# EAGLE design BeaconKeyer_RevC (EAGLE 7.6.0)

## Sheet 1 of 2
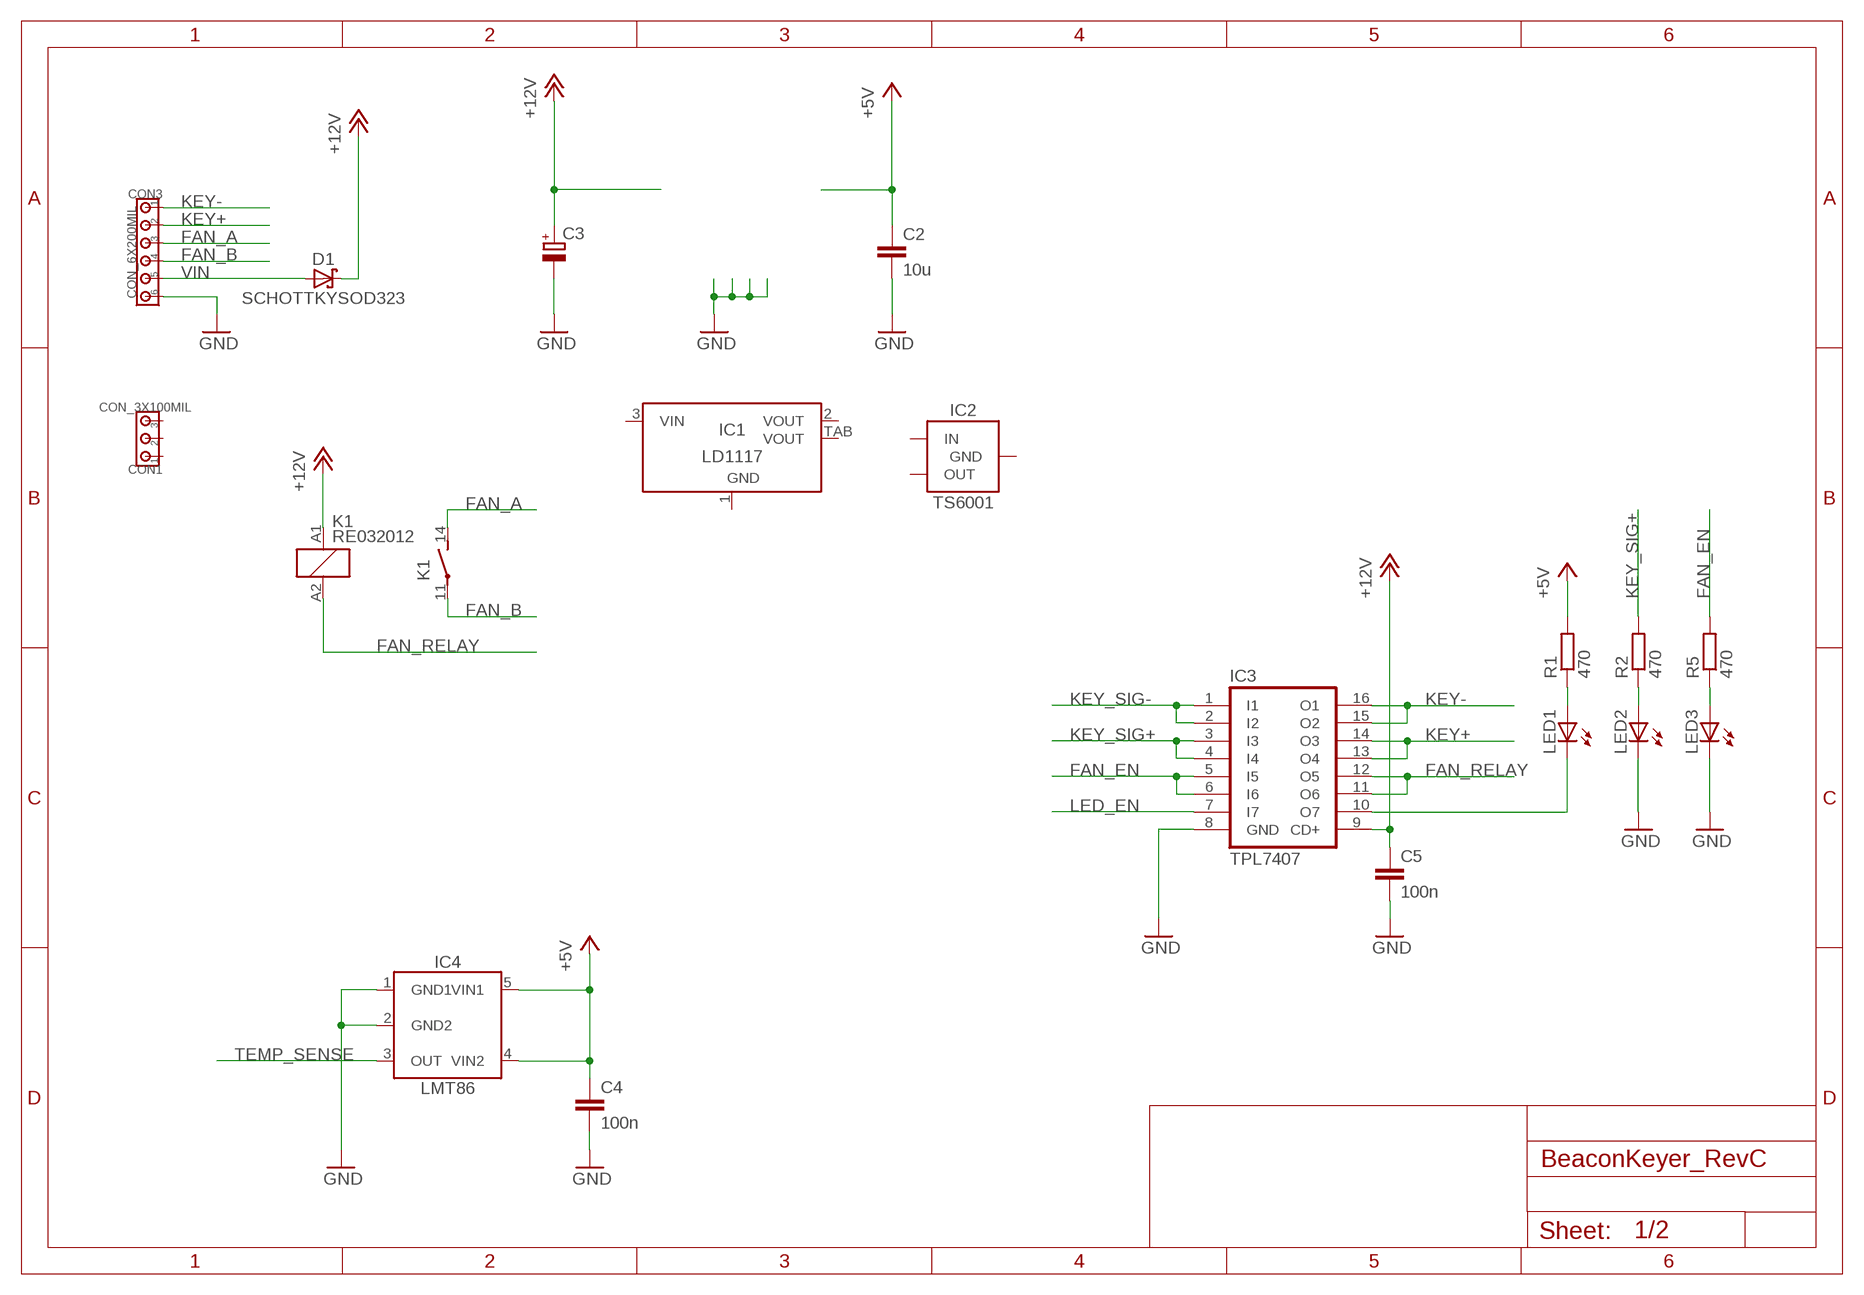
[diagram p0: schematic, sheet 1]

### Parts
C2  10u  CC0805  [C0805]
C3  C_POLARIZEDSMC_B  [SMC_B]
C4  100n  CC0805  [C0805]
C5  100n  CC0805  [C0805]
CON1  CON_3X100MIL  [100MIL_3X]
CON3  CON_6X200MIL  [200MIL_6X]
D1  SCHOTTKYSOD323  [SOD323]
IC1  LD1117  [SOT223]
IC2  TS6001  [SOT23]
IC3  TPL7407  ULN2003  [SO16]
IC4  LMT86  [SC70-5]
K1  RE032012  [RE-SCHRACK]
LED1  LED0805  [LED0805]
LED2  LED0805  [LED0805]
LED3  LED0805  [LED0805]
R1  470  RESISTORR0805  [R0805]
R2  470  RESISTORR0805  [R0805]
R5  470  RESISTORR0805  [R0805]

### Nets
+5V: C2.1 C4.1 IC4.4(VIN2) IC4.5(VIN1) R1.2
+12V: C3.+ C5.1 D1.C IC3.9(CD+) K1.A1 ; also sheet 2
FAN_A: CON3.3 K1.14(2:S)
FAN_B: CON3.4 K1.11(2:P)
FAN_EN: IC3.5(I5) IC3.6(I6) R5.2
FAN_RELAY: IC3.11(O6) IC3.12(O5) K1.A2
GND: C2.2 C3.- C4.2 C5.2 CON3.6 IC3.8(GND) IC4.1(GND1) IC4.2(GND2) LED2.C LED3.C ; also sheet 2
KEY+: CON3.2 IC3.13(O4) IC3.14(O3)
KEY-: CON3.1 IC3.15(O2) IC3.16(O1)
KEY_SIG+: IC3.3(I3) IC3.4(I4) R2.2
KEY_SIG-: IC3.1(I1) IC3.2(I2)
LED_EN: IC3.7(I7)
N$1: LED2.A R2.1
N$2: LED1.A R1.1
N$4: IC3.10(O7) LED1.C
N$5: LED3.A R5.1
TEMP_SENSE: IC4.3(OUT)
VIN: CON3.5 D1.A
Unconnected: CON1.1 CON1.2 CON1.3 IC1.2(VOUT) IC1.3(VIN) IC1.TAB(VOUT) IC2.2(OUT)

## Sheet 2 of 2
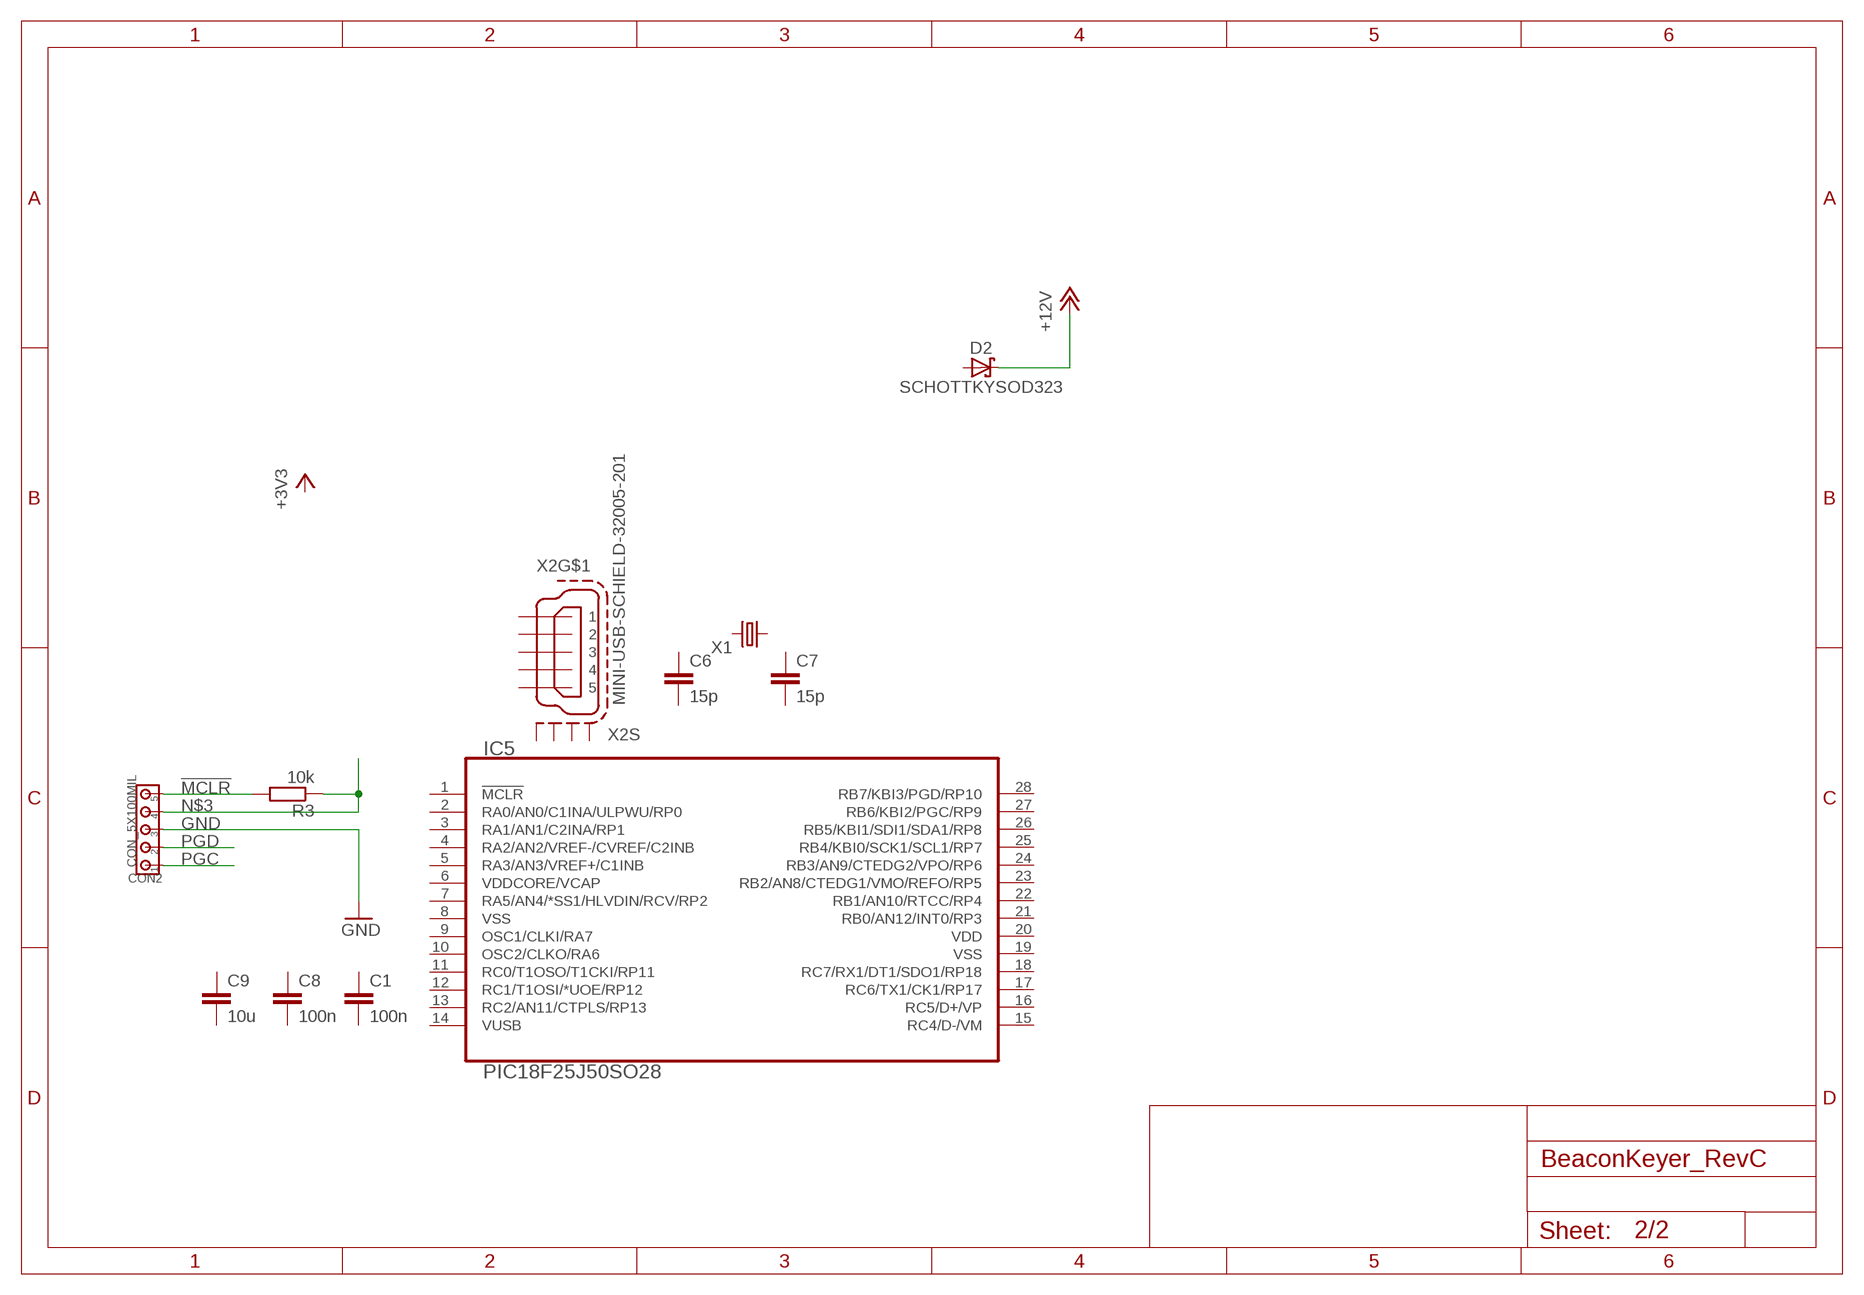
[diagram p1: schematic, sheet 2]

### Parts
C1  100n  CC0805  [C0805]
C6  15p  CC0805  [C0805]
C7  15p  CC0805  [C0805]
C8  100n  CC0805  [C0805]
C9  10u  CC0805  [C0805]
CON2  CON_5X100MIL  [100MIL_5X]
D2  SCHOTTKYSOD323  [SOD323]
IC5  PIC18F25J50SO28  [SO28W]
R3  10k  RESISTORR0805  [R0805]
X1  CRYSTAL5X3.2MM  [5X3.2MM]
X2  MINI-USB-SCHIELD-32005-201  [32005-201]

### Nets
!MCLR!: CON2.5 R3.2
+12V: D2.C ; also sheet 1
GND: CON2.3 ; also sheet 1
N$3: CON2.4 R3.1
PGC: CON2.1
PGD: CON2.2
Unconnected: C1.1 C1.2 C6.1 C6.2 C7.1 C7.2 C8.1 C8.2 C9.1 C9.2 D2.A IC5.1(!MCLR!) IC5.2(RA0/AN0/C1INA/ULPWU/RP0) IC5.3(RA1/AN1/C2INA/RP1) IC5.4(RA2/AN2/VREF-/CVREF/C2INB) IC5.5(RA3/AN3/VREF+/C1INB) IC5.7(RA5/AN4/*SS1/HLVDIN/RCV/RP2) IC5.8(VSS) IC5.9(OSC1/CLKI/RA7) IC5.10(OSC2/CLKO/RA6) IC5.11(RC0/T1OSO/T1CKI/RP11) IC5.12(RC1/T1OSI/*UOE/RP12) IC5.13(RC2/AN11/CTPLS/RP13) IC5.15(RC4/D-/VM) IC5.16(RC5/D+/VP) IC5.17(RC6/TX1/CK1/RP17) IC5.18(RC7/RX1/DT1/SDO1/RP18) IC5.19(VSS) IC5.21(RB0/AN12/INT0/RP3) IC5.22(RB1/AN10/RTCC/RP4) IC5.23(RB2/AN8/CTEDG1/VMO/REFO/RP5) IC5.24(RB3/AN9/CTEDG2/VPO/RP6) IC5.25(RB4/KBI0/SCK1/SCL1/RP7) IC5.26(RB5/KBI1/SDI1/SDA1/RP8) IC5.27(RB6/KBI2/PGC/RP9) IC5.28(RB7/KBI3/PGD/RP10) X1.1 X1.2 X2.1 X2.2 X2.3 X2.4 X2.5 X2.M1(S:S1) X2.M2(S:S2) X2.M3(S:S3) X2.M4(S:S4)

## Power pins joined to a net without a drawn wire
GND: IC1.1(GND) IC2.3(GND)
IN: IC2.1(IN)
VDD: IC5.20(VDD)
VDDCORE/VCAP: IC5.6(VDDCORE/VCAP)
VUSB: IC5.14(VUSB)

## Library data of the parts
C1 C2 C4-C9 = 00Capacitor:C: Capacitor
C3 = 00Capacitor:C_POLARIZED
CON1 = 00Connector:CON_3X: 3-pin header
CON2 = 00Connector:CON_5X: 5-pin header
CON3 = 00Connector:CON_6X: 6-pin header
D1 D2 = 00Diode:SCHOTTKY
IC1 = 00VoltageRegulator:LD1117: Positive Voltage Regulator 800mA
IC2 = 00VoltageReference:TS6001: 2.5V Voltage Reference in SOT23
IC3 = 00Transistor:ULN2003: Seven Darlington array
IC4 = 00Sensor:LMT86: Analog Temperature Sensors with Class-AB Output
IC5 = 00PIC:PIC18F*J50: PIC18F Series 28-Pin Microcontroller; MEMORY: 32k
K1 = relay:RE03*: Miniature PCB Relay 1 pole 6 A SCHRACK Source: http://www.schrack.com/.. 5812.pdf; MPN: RE032012; OC_FARNELL: 9659684; OC_NEWARK: 97K8813
LED1-LED3 = 00Display:LED: LED
R1-R3 R5 = 00Resistor:RESISTOR: RESISTOR, European symbol
X1 = 00Crystal:CRYSTAL: Crystal
X2 = con-cypressindustries:MINI-USB-SCHIELD-: MINI USB-B Conector Source: www.cypressindustries.com; OC_FARNELL: unknown; OC_NEWARK: unknown

## Board
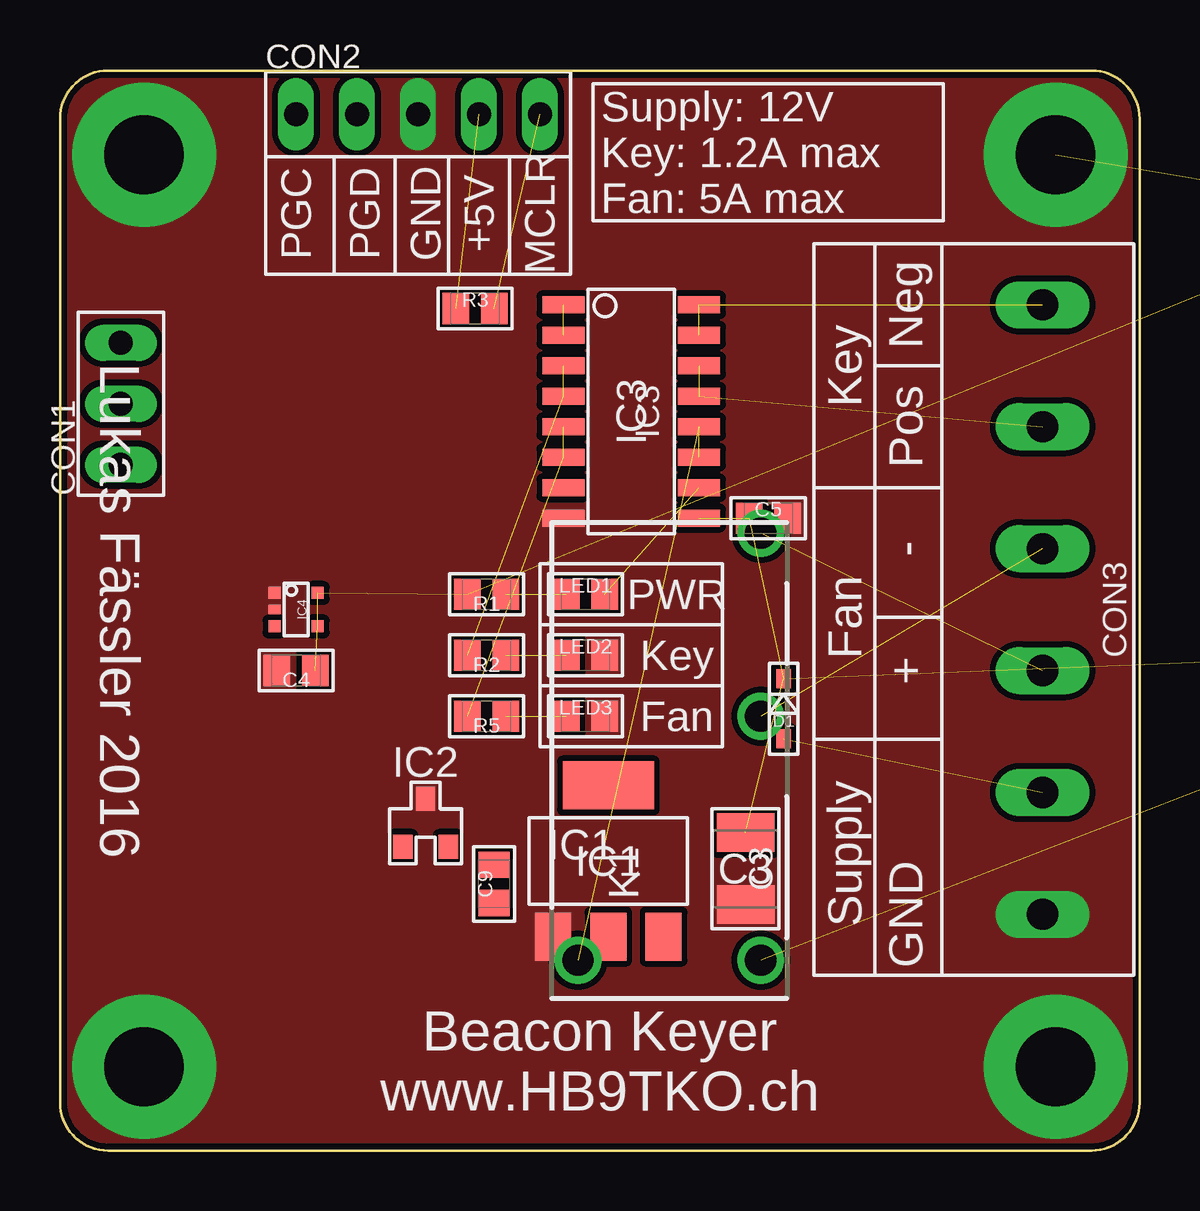
[diagram p2: board, top side]
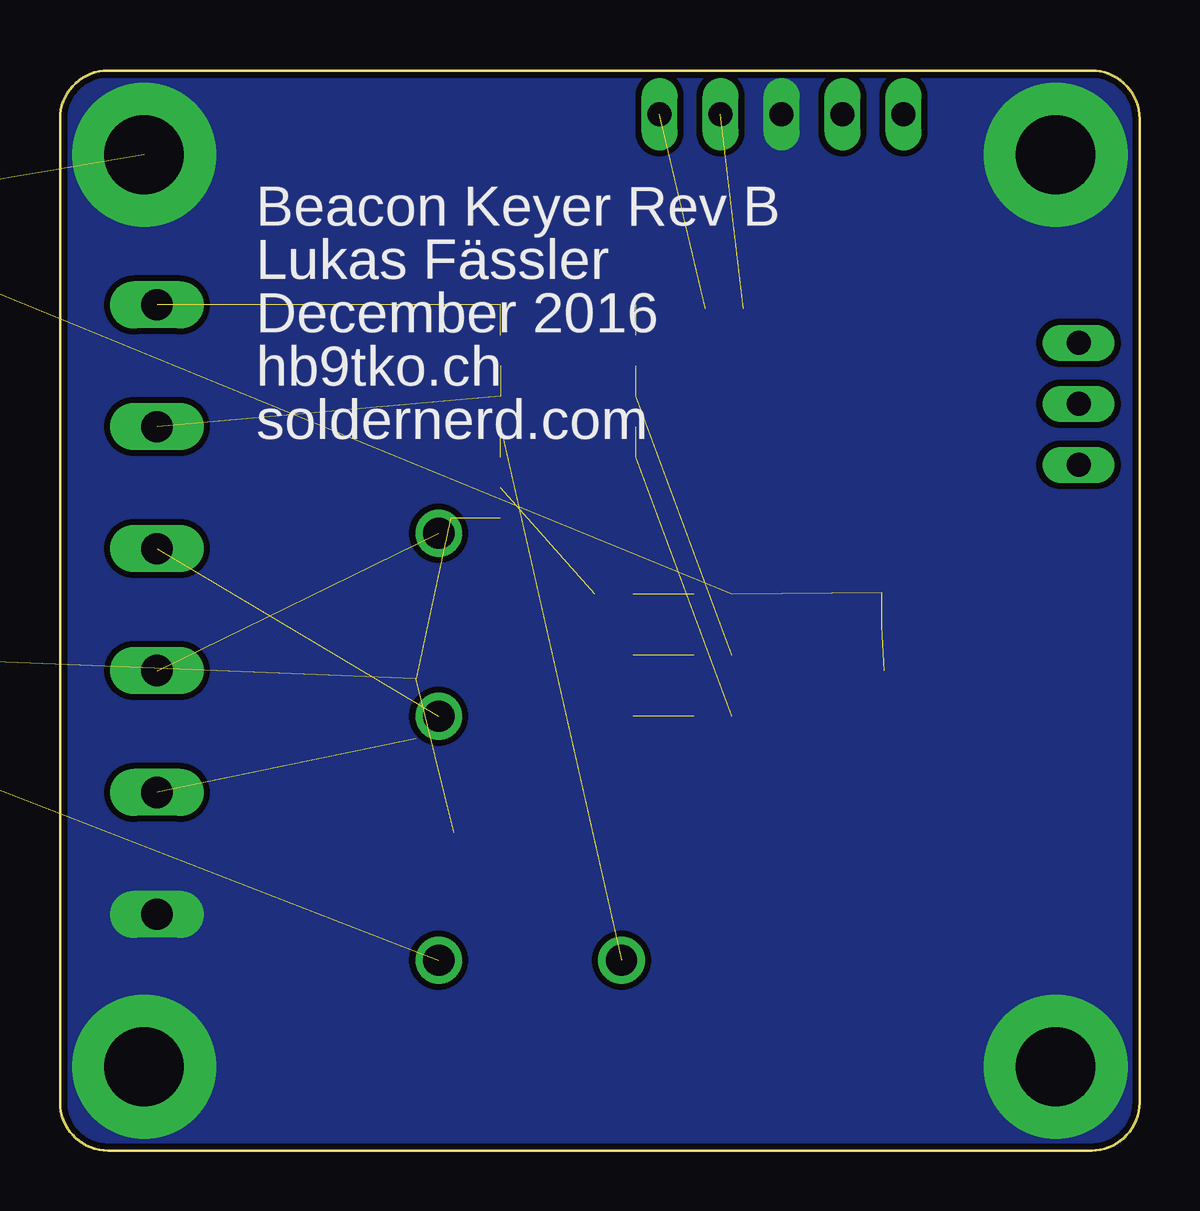
[diagram p3: board, bottom side, seen from below]

Size 45 x 45 mm. Coordinates in mm from the lower left corner, seen from the top.
Outline: 0,43 arc-90 2,45 43,45 arc-90 45,43 45,2 arc-90 43,0 2,0 arc-90 0,2 0,43
Copper layers (1*16): Top 0.035mm / dielectric 1.5mm / Bottom 0.035mm
Design rules "dirt_cheap_dirty_boards.v1 *": minimum track width 5mil, minimum drill 12mil, track to track 8mil, track to pad 8mil, pad to pad 8mil, via to via 8mil, smd to smd 0mil, copper to edge 10mil, drill to drill 10mil, minimum pad ring 10mil, minimum via ring 6mil, stop-mask expansion 2mil, vias tented up to drill 25mil, thermal gap 10mil

### Footprints (pad centres in the part's own frame; a part is rotated, then mirrored left to right if it is on the bottom)
C0805 = smd 1.1 x 1.3: 1 -0.8,0; 2 0.8,0
SMC_B = smd 1.6 x 2.4: + -1.5,0; - 1.5,0
100MIL_3X = drill 1 long: 1 -2.54,0; 2 0,0; 3 2.54,0
100MIL_5X = drill 1 long: 1 -5.08,0; 2 -2.54,0; 3 0,0; 4 2.54,0; 5 5.08,0
200MIL_6X = drill 1.3 long: 1 -12.7,0; 2 -7.62,0; 3 -2.54,0; 4 2.54,0; 5 7.62,0; 6 12.7,0
SOD323 = smd 0.8 x 0.6: A 1.25,0; C -1.25,0
SOT223 = smd 1.5 x 2: 1 -2.3,-3.15; 2 0,-3.15; 3 2.3,-3.15 | smd 3.8 x 2: TAB 0,3.15
SOT23 = smd 0.8 x 1: 1 -0.95,-1; 2 0.95,-1; 3 0,1
SO16 = smd 0.7 x 1.75: 1 -4.445,-2.825; 2 -3.175,-2.825; 3 -1.905,-2.825; 4 -0.635,-2.825; 5 0.635,-2.825; 6 1.905,-2.825; 7 3.175,-2.825; 8 4.445,-2.825; 9 4.445,2.825; 10 3.175,2.825; 11 1.905,2.825; 12 0.635,2.825; 13 -0.635,2.825; 14 -1.905,2.825; 15 -3.175,2.825; 16 -4.445,2.825
SC70-5 = smd 0.5 x 0.5: 1 -0.7,-0.9; 3 0.7,-0.9; 4 0.7,0.9; 5 -0.7,0.9 | smd 0.4 x 0.5: 2 0,-0.9
SO28W = smd 0.65 x 1.7: 1 -7.62,-4.78; 2 -6.35,-4.78; 3 -5.08,-4.78; 4 -3.81,-4.78; 5 -2.54,-4.78; 6 -1.27,-4.78; 7 0,-4.78; 8 1.27,-4.78; 9 2.54,-4.78; 10 3.81,-4.78; 11 5.08,-4.78; 12 6.35,-4.78; 13 7.62,-4.78; 14 8.89,-4.78; 15 8.89,4.78; 16 7.62,4.78; 17 6.35,4.78; 18 5.08,4.78; 19 3.81,4.78; 20 2.54,4.78; 21 1.27,4.78; 22 0,4.78; 23 -1.27,4.78; 24 -2.54,4.78; 25 -3.81,4.78; 26 -5.08,4.78; 27 -6.35,4.78; 28 -7.62,4.78
RE-SCHRACK = drill 1.3: 11 8.89,-3.81; 14 1.27,-3.81; A1 -8.89,-3.81; A2 -8.89,3.81
LED0805 = smd 1.1 x 1.3: A -0.8,0; C 0.8,0
R0805 = smd 1.1 x 1.3: 1 -0.8,0; 2 0.8,0
5X3.2MM = smd 1.9 x 2.4: 1 -2.05,0; 2 2.05,0
32005-201 = smd 3.1 x 0.5: 1 3,1.6; 2 3,0.8; 3 3,0; 4 3,-0.8; 5 3,-1.6 | smd 2.5 x 2: M1 -3,-4.45; M2 -3,4.45 | smd 3.3 x 2: M3 2.9,4.45; M4 2.9,-4.45 | hole 0.9: 0,2.2; 0,-2.2

### Placement (x,y rotation side)
C1  49.85,38.73 270 top  (outside the outline)
C2  53.02,38.73 90 top  (outside the outline)
C3  28.57,11.75 270 top
C4  9.84,20 180 top
C5  29.53,26.35 0 top
C6  70.8,33.97 0 top  (outside the outline)
C7  70.8,29.53 0 top  (outside the outline)
C8  55.88,38.73 90 top  (outside the outline)
C9  18.1,11.11 90 top
CON1  2.54,31.11 90 top
CON2  14.92,43.18 0 top
CON3  40.96,22.54 270 top
D1  30.16,18.41 270 top
D2  62.87,22.23 90 top  (outside the outline)
IC1  22.86,12.06 0 top
IC2  15.24,13.65 0 top
IC3  23.81,30.8 270 top
IC4  9.84,22.54 270 top
IC5  55.24,26.67 270 top  (outside the outline)
K1  25.4,16.83 90 top
LED1  21.91,23.18 0 top
LED2  21.91,20.64 0 top
LED3  21.91,18.1 0 top
R1  17.78,23.18 180 top
R2  17.78,20.64 180 top
R3  17.3,35.08 0 top
R5  17.78,18.1 180 top
X1  66.36,31.75 90 top  (outside the outline)
X2  69.85,21.59 90 top  (outside the outline)

### Tracks (layer width: path | path; a pad name or v marks a point on that pad's centre or on a via)
!MCLR!  (1 unrouted)
+5V  (4 unrouted)
+12V  (5 unrouted)
FAN_A  (1 unrouted)
FAN_B  (1 unrouted)
FAN_EN  (2 unrouted)
FAN_RELAY  (2 unrouted)
GND  (via drill 3.3 pad 6)  (1 unrouted)
  other vias: 3.5,41.5 41.5,41.5 41.5,3.5 3.5,3.5
  pour Bottom (isolate 0.254, rank 2, no thermals): 0,30 0,43 arc-90 2,45 20,45 43,45 arc-90 45,43 45,25 45,2 arc-90 43,0 25,0 2,0 arc-90 0,2
  pour Top (isolate 0.254, rank 4, no thermals): 0,20 0,43 arc-90 2,45 25,45 43,45 arc-90 45,43 45,15 45,2 arc-90 43,0 25,0 2,0 arc-90 0,2
KEY+  (2 unrouted)
KEY-  (2 unrouted)
KEY_SIG+  (2 unrouted)
KEY_SIG-  (1 unrouted)
N$1  (1 unrouted)
N$2  (1 unrouted)
N$3  (1 unrouted)
N$4  (1 unrouted)
N$5  (1 unrouted)
VIN  (1 unrouted)

### Text on the board
tPlace: Supply: 12V | Key: 1.2A max | Fan: 5A max | PGC | PGD | GND | +5V | MCLR | Neg | Key | Pos | - | PWR | Lukas Fässler 2016 | Fan | Key | + | Fan | Supply | GND | Beacon Keyer | www.HB9TKO.ch
bPlace: Beacon Keyer Rev B | Lukas Fässler | December 2016 | hb9tko.ch | soldernerd.com